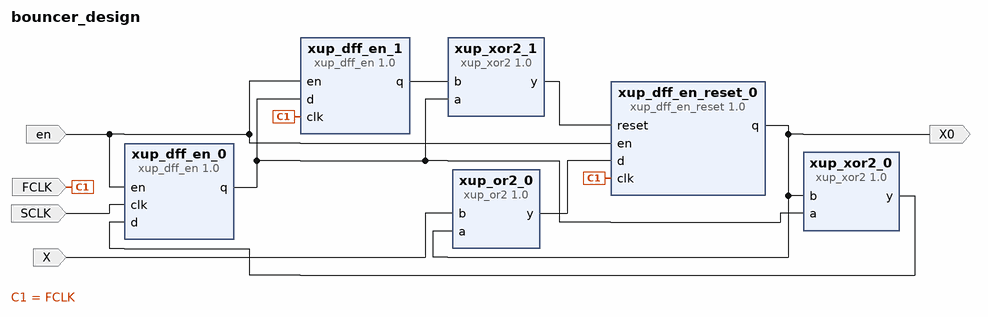
[diagram p0: block diagram of the top level]
# Vivado block design bouncer_design, xc7a35tcpg236-1, Vivado 2023.1
create_bd_design bouncer_design

create_bd_port -dir I X
create_bd_port -dir I SCLK
create_bd_port -dir I FCLK
create_bd_port -dir I en
create_bd_port -dir O X0

create_bd_cell -type ip -vlnv xilinx.com:XUP:xup_dff_en_reset:1.0 xup_dff_en_reset_0
create_bd_cell -type ip -vlnv xilinx.com:XUP:xup_or2:1.0 xup_or2_0
create_bd_cell -type ip -vlnv xilinx.com:XUP:xup_xor2:1.0 xup_xor2_0
create_bd_cell -type ip -vlnv xilinx.com:XUP:xup_xor2:1.0 xup_xor2_1
create_bd_cell -type ip -vlnv xilinx.com:XUP:xup_dff_en:1.0 xup_dff_en_0
create_bd_cell -type ip -vlnv xilinx.com:XUP:xup_dff_en:1.0 xup_dff_en_1

# ---- connections ----

connect_bd_net [get_bd_ports FCLK] [get_bd_pins xup_dff_en_1/clk] [get_bd_pins xup_dff_en_reset_0/clk]
connect_bd_net [get_bd_ports SCLK] [get_bd_pins xup_dff_en_0/clk]
connect_bd_net [get_bd_ports X] [get_bd_pins xup_or2_0/b]
connect_bd_net [get_bd_ports en] [get_bd_pins xup_dff_en_reset_0/en] [get_bd_pins xup_dff_en_0/en] [get_bd_pins xup_dff_en_1/en]
connect_bd_net [get_bd_pins xup_dff_en_0/q] [get_bd_pins xup_xor2_0/a] [get_bd_pins xup_dff_en_1/d] [get_bd_pins xup_xor2_1/a]
connect_bd_net [get_bd_pins xup_dff_en_1/q] [get_bd_pins xup_xor2_1/b]
connect_bd_net [get_bd_pins xup_dff_en_reset_0/q] [get_bd_pins xup_or2_0/a] [get_bd_pins xup_xor2_0/b] [get_bd_ports X0]
connect_bd_net [get_bd_pins xup_or2_0/y] [get_bd_pins xup_dff_en_reset_0/d]
connect_bd_net [get_bd_pins xup_xor2_0/y] [get_bd_pins xup_dff_en_0/d]
connect_bd_net [get_bd_pins xup_xor2_1/y] [get_bd_pins xup_dff_en_reset_0/reset]

validate_bd_design
save_bd_design
